# EasyEDA schematic SCH_LFR_BODY_PCB_1_2025-05-22.json
TITLE: Sheet_1; REV: 1.0; Date: 2025-05-18; Sheet: 1/1; Drawn By: shahriar2203041; Company: Joy Bangla
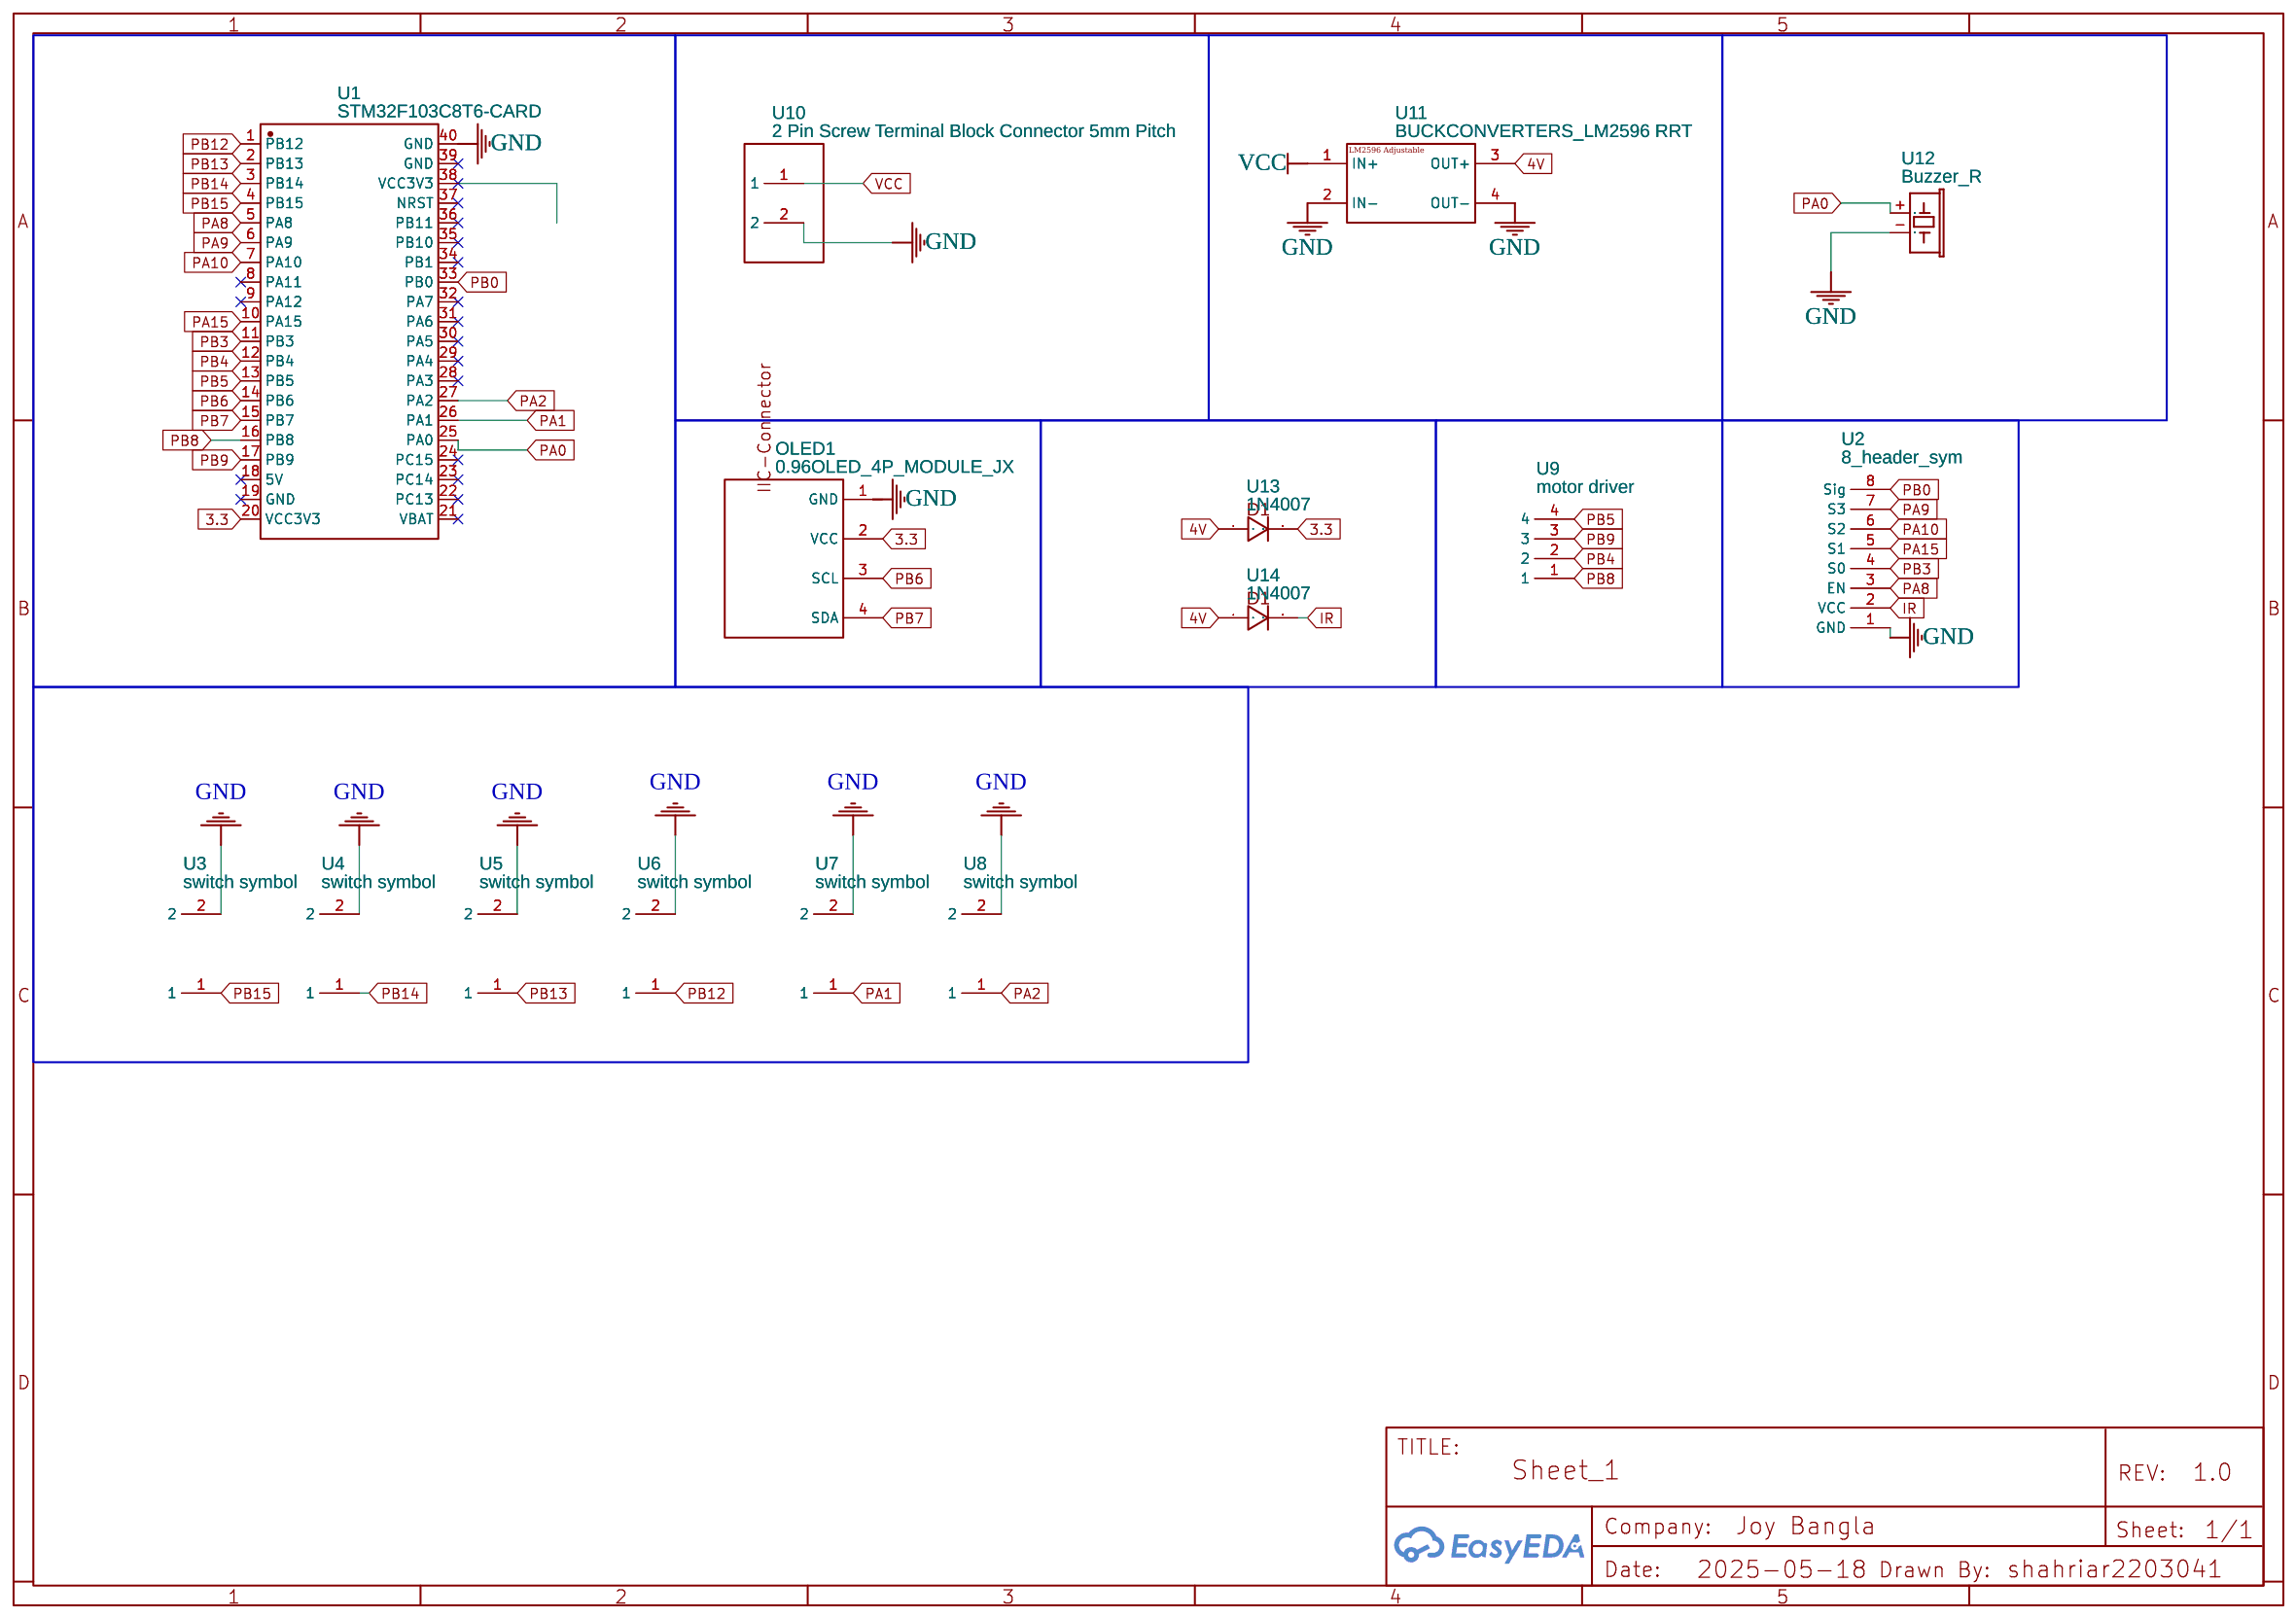
[diagram p0: schematic sheet]

## Parts
OLED1  0.96OLED_4P_MODULE_JX  [0.96OLED_4P]
U1  STM32F103C8T6-CARD  [CONN-TH_L53.3-W22.9_STM32F103C8T6-CARD]
U2  8_header_sym  [8_HEADER_FOOT]
U3  switch symbol  [SWITCH_FOOT]
U4  switch symbol  [SWITCH_FOOT]
U5  switch symbol  [SWITCH_FOOT]
U6  switch symbol  [SWITCH_FOOT]
U7  switch symbol  [SWITCH_FOOT]
U8  switch symbol  [SWITCH_FOOT]
U9  motor driver  [MOTOR_DRIVER_FOOT]
U10  2 Pin Screw Terminal Block Connector 5mm Pitch  [GIKFUN 2 PIN PIN SCREW TERMINAL BLOCK CONNECTOR 5MM PITCH (EK8365C)]
U11  BUCKCONVERTERS_LM2596 RRT  [LM2596:YAAJ_DCDC_STEPDOWN_LM2596]
U12  Buzzer_R  [BUZZERROLO]
U13  1N4007  [DIODE_1N4007]
U14  1N4007  [DIODE_1N4007]

## Library data of the parts
OLED1 = 0.96OLED_4P_MODULE_JX: Contributor: LCSC; Supplier: LCSC; Supplier Part: C9900004566; Manufacturer: null; JLCPCB Part Class: Extended Part
U1 = STM32F103C8T6-CARD: Supplier: LCSC; Supplier Part: C9900077949; Manufacturer: null; Manufacturer Part: STM32F103C8T6-Card; Contributor: lcsc
U2 = 8_header_sym: Contributor: shahriar2203041
U3-U8 = switch symbol: Contributor: shahriar2203041
U9 = motor driver: Contributor: shahriar2203041
U10 = Gikfun 2 Pin Screw Terminal Block Connector 5mm Pitch EK8365C Schematic: Manufacturer: Gikfun; Manufacturer Part: EK8365C; Supplier: Gikfun; Supplier Part: EK8365C; Contributor: pabalate28
U11 = BuckConverters_LM2596_Adj: Servo 5V; Add into BOM: yes; Convert to PCB: yes; Origin Footprint: YAAJ_DCDC_StepDown_LM2596; Contributor: wahyusuryantara3581
U12 = Buzzer_R: Contributor: RoloSoft
U13 U14 = 1N4007: Contributor: tomcanivet

## Nets
4V: U11.3(OUT+) U13.1(2) U14.1(2)
GND: OLED1.1(GND) U1.40(GND) U2.1(GND) U3.2 U4.2 U5.2 U6.2 U7.2 U8.2 U10.2 U11.2(IN-) U11.4(OUT-) U12.-(2)
VCC: U10.1 U11.1(IN+)
3.3: OLED1.2(VCC) U1.20(VCC3V3) U13.2(1)
IR: U2.2(VCC) U14.2(1)
PA0: U1.25(PA0) U12.+(1)
PA1: U1.26(PA1) U7.1
PA2: U1.27(PA2) U8.1
PA8: U1.5(PA8) U2.3(EN)
PA9: U1.6(PA9) U2.7(S3)
PA10: U1.7(PA10) U2.6(S2)
PA15: U1.10(PA15) U2.5(S1)
PB0: U1.33(PB0) U2.8(Sig)
PB3: U1.11(PB3) U2.4(S0)
PB4: U1.12(PB4) U9.2
PB5: U1.13(PB5) U9.4
PB6: OLED1.3(SCL) U1.14(PB6)
PB7: OLED1.4(SDA) U1.15(PB7)
PB8: U1.16(PB8) U9.1
PB9: U1.17(PB9) U9.3
PB12: U1.1(PB12) U6.1
PB13: U1.2(PB13) U5.1
PB14: U1.3(PB14) U4.1
PB15: U1.4(PB15) U3.1

Not connected (* = marked no-connect by the designer): U1 8(PA11)* 9(PA12)* 18(5V)* 19(GND)* 21(VBAT)* 22(PC13)* 23(PC14)* 24(PC15)* 28(PA3)* 29(PA4)* 30(PA5)* 31(PA6)* 32(PA7)* 34(PB1)* 35(PB10)* 36(PB11)* 37(NRST)* 38(VCC3V3)* 39(GND)*
